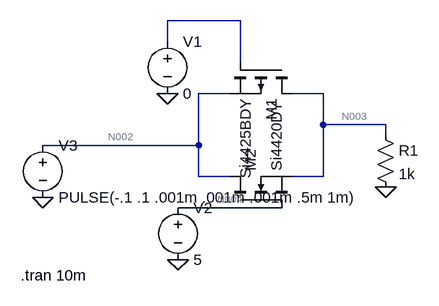
[diagram p0: schematic cmos.asc]
cmos.asc, the LTspice schematic file:
Version 4
SHEET 1 880 680
WIRE -48 -192 -160 -192
WIRE -160 -160 -160 -192
WIRE -48 -128 -48 -192
WIRE -64 -80 -112 -80
WIRE 80 -80 32 -80
WIRE 80 -32 80 -80
WIRE 176 -32 80 -32
WIRE 176 -16 176 -32
WIRE -112 0 -112 -80
WIRE -112 0 -352 0
WIRE -112 48 -112 0
WIRE -64 48 -112 48
WIRE 80 48 80 -32
WIRE 80 48 32 48
WIRE 16 96 -144 96
FLAG -160 -80 0
FLAG -144 176 0
FLAG -352 80 0
FLAG 176 64 0
SYMBOL pmos 32 -128 R90
SYMATTR InstName M1
SYMATTR Value Si4425BDY
SYMBOL nmos -64 96 R270
SYMATTR InstName M2
SYMATTR Value Si4420DY
SYMBOL voltage -160 -176 R0
WINDOW 123 0 0 Left 2
WINDOW 39 0 0 Left 2
SYMATTR InstName V1
SYMATTR Value 0
SYMBOL voltage -144 80 R0
WINDOW 123 0 0 Left 2
WINDOW 39 0 0 Left 2
SYMATTR InstName V2
SYMATTR Value 5
SYMBOL voltage -352 -16 R0
WINDOW 123 0 0 Left 2
WINDOW 39 0 0 Left 2
SYMATTR InstName V3
SYMATTR Value PULSE(-.1 .1 .001m .001m .001m .5m 1m)
SYMBOL res 160 -32 R0
SYMATTR InstName R1
SYMATTR Value 1k
TEXT -386 200 Left 2 !.tran 10m

The netlist it stands for:
* cmos.asc
M1 N003 N001 N002 N002 Si4425BDY
M2 N002 N004 N003 N003 Si4420DY
V1 N001 0 0
V2 N004 0 5
V3 N002 0 PULSE(-.1 .1 .001m .001m .001m .5m 1m)
R1 N003 0 1k
.model NMOS NMOS
.model PMOS PMOS
.lib standard.mos
.tran 10m
.backanno
.end

* Results of the author's LTspice run, read from the files saved beside the schematic
* Operating Point, zero values left out:
*   V(n003) = -100 mV
*   V(n002) = -100 mV
*   V(n004) = 5 V
*   Id(M2) = -100 µA
*   Is(M2) = 100 µA
*   I(R1) = -100 µA
*   I(V3) = 100 µA
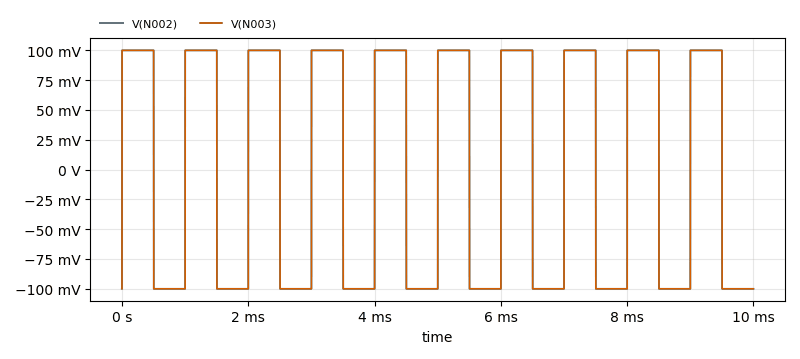
[diagram p1: Transient Analysis of cmos.asc, plotted from the saved traces]
* Transient Analysis, 1 run:
*   V(N002): min -100 mV, max 100 mV, average 200 µV, rms 99.98 mV, last -100 mV
*   V(N003): min -100 mV, max 100 mV, average 200 µV, rms 99.98 mV, last -100 mV